# Altium schematic sheet Sheet1.SchDoc
size A; SheetNumber: 1; SheetTotal: 1
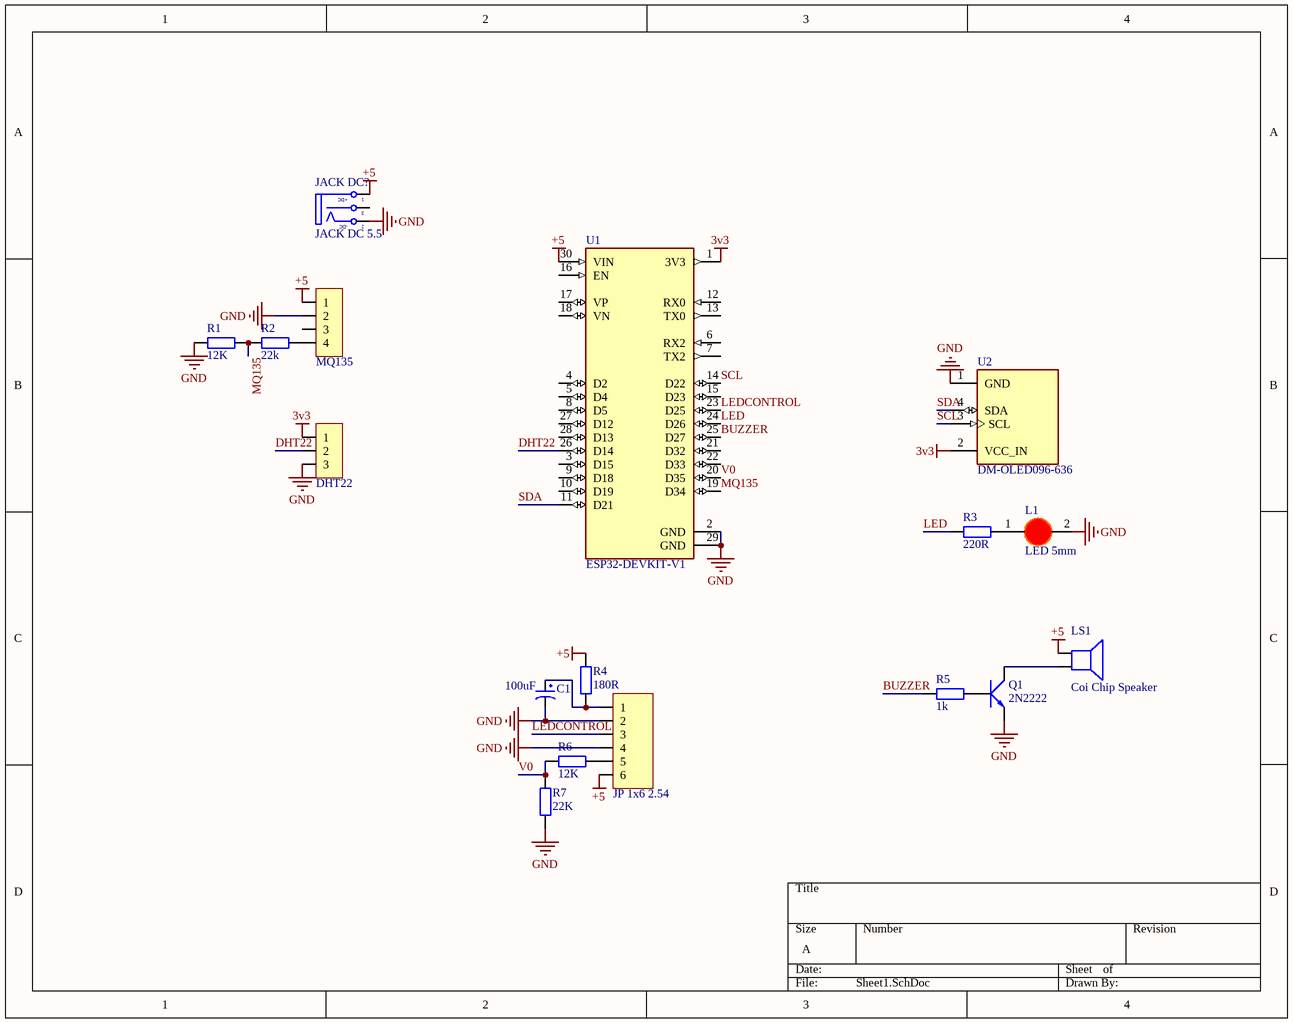
[diagram p0: Sheet1.SchDoc]

## Parts
C1  100uF  [tu hoa 5mm]
DHT1  DHT22  [JP 1x3 CT]
JACK_DC?  JACK DC 5.5  [JACK DC 5.5]
JP1  JP 1x6 2.54  [JP 1x6 DT]
L1  LED 5mm  [LED-5MM-RED]
LS1  Coi Chip Speaker  [Coi Chip Speacker]
MQ1  MQ135  [JP 1x4 CT]
Q1  2N2222  [TO92]
R1  12K  [tro vach 1/4w]
R2  22k  [tro vach 1/4w]
R3  220R  [tro vach 1/4w]
R4  180R  [tro vach 1/4w]
R5  1k  [tro vach 1/4w]
R6  12K  [tro vach 1/4w]
R7  22K  [tro vach 1/4w]
U1  ESP32-DEVKIT-V1  [MODULE_ESP32_DEVKIT_V1]
U2  DM-OLED096-636  [MODULE_DM-OLED096-636]

## Nets
3v3: DHT1.1 U1.1(3V3) U2.2(VCC_IN)
+5: JACK_DC?.1(T) JP1.6 LS1.1 MQ1.1 R4.1 U1.30(VIN)
GND: C1.2 DHT1.3 JACK_DC?.2(TN) JP1.2 JP1.4 L1.2(K) MQ1.2 Q1.1(E) R1.1 R7.1 U1.2(GND) U1.29(GND) U2.1(GND)
BUZZER: R5.1 U1.25(D27)
DHT22: DHT1.2 U1.26(D14)
LED: R3.1 U1.24(D26)
LEDCONTROL: JP1.3 U1.23(D25)
MQ135: R1.2 R2.1 U1.19(D34)
SCL: U1.14(D22) U2.3(SCL)
SDA: U1.11(D21) U2.4(SDA)
V0: R6.1 R7.2 U1.20(D35)
NetC1_1: C1.1 JP1.1 R4.2
NetJP1_5: JP1.5 R6.2
NetL1_1: L1.1(A) R3.2
NetLS1_2: LS1.2 Q1.3(C)
NetMQ1_4: MQ1.4 R2.2
NetQ1_2: Q1.2(B) R5.2

Not connected (* = marked no-connect by the designer): JACK_DC? 3(S); MQ1 3; U1 3(D15) 4(D2) 5(D4) 6(RX2) 7(TX2) 8(D5) 9(D18) 10(D19) 12(RX0) 13(TX0) 15(D23) 16(EN) 17(VP) 18(VN) 21(D32) 22(D33) 27(D12) 28(D13)

## Notes on the sheet
- (in symbol JACK DC 5.5) +DC; -DC

## Library data of the parts
C1 = Tu Hoa 100uF 25V 6x11: Cắm; Don_Vi: Con; So_Chan: 2; Ten_Linh_Kien: Tụ Hóa 100uF 25V 6x11MM; Ma_Hang: MH001351; Chung_Loai: Cắm; Kieu_Chan: *
DHT1 = JP 1x3 2.54 Cai Thang: Cắm; Ten_Linh_Kien: Jump Đơn Cái 2.54MM 1x20P Thẳng; Don_Vi: Con; Ma_Hang: MH004006; Ghi_Chu: *; Kieu_Chan: *; Chung_Loai: Cắm
JACK_DC? = JACK DC 5.5: Value: Jac DC
JP1 = JP 1x6 2.54 Duc Thang: Cắm; Ten_Linh_Kien: Jump Đơn Đực 2.54MM 1x40P Thẳng 11MM; Don_Vi: Con; Ma_Hang: MH000903; Ghi_Chu: *; Kieu_Chan: *; Chung_Loai: Cắm
L1 = LED 5mm Do: Cắm; Don_Vi: Con; Ma_Hang: MH008967; Ten_Linh_Kien: Led 5MM Phủ Đỏ (1000c); Ghi_Chu: *; Kieu_Chan: *; Chung_Loai: Cắm
LS1 = Coi Chip Speaker: Còi chip
MQ1 = JP 1x4 2.54 Cai Thang: Cắm; Ten_Linh_Kien: Jump Đơn Cái 2.54MM 1x20P Thẳng; Don_Vi: Con; Ma_Hang: MH004006; Ghi_Chu: *; Kieu_Chan: *; Chung_Loai: Cắm
Q1 = Trans 2N3904: NPN transistor EBC; Value: C9014
R1 R7 = Tro Vach 1/4W 5% 39k: Cắm; Don_Vi: Con; So_Chan: 2; Ten_Linh_Kien: Trở Vạch 1/4w 5% 39k; Ma_Hang: MH007314; Chung_Loai: Cắm; Kieu_Chan: *
R2 R6 = Tro Vach 1/4W 5% 22k: Cắm; Don_Vi: Con; So_Chan: 2; Ten_Linh_Kien: Trở Vạch 1/4w 5% 22k; Ma_Hang: MH007301; Chung_Loai: Cắm; Kieu_Chan: *
R3 = Tro Vach 1/4W 5% 220R: Cắm; Don_Vi: Con; So_Chan: 2; Ten_Linh_Kien: Trở Vạch 1/4w 5% 220R; Ma_Hang: MH007300; Chung_Loai: Cắm; Kieu_Chan: *
R4 = Tro Vach 1/4W 5% 180R: Cắm; Don_Vi: Con; Ten_Linh_Kien: Trở Vạch 1/4w 5% 180R; Ma_Hang: MH007290; So_Chan: 2; Chung_Loai: Cắm; Kieu_Chan: *
R5 = Tro Vach 1/4W 5% 1k: Cắm; Don_Vi: Con; So_Chan: 2; Ten_Linh_Kien: Trở Vạch 1/4w 5% 1k; Ma_Hang: MH007390; Chung_Loai: Cắm; Kieu_Chan: *
U1 = ESP32-DEVKIT-V1: Dual core, Wi-Fi: 2.4 GHz up to 150 Mbits/s,BLE (Bluetooth Low Energy) and legacy Bluetooth, 32 bits, Up to 240 MHz; MF: Do it; SnapEDA_Link: https://www.snapeda.com/parts/ESP32-DEVKIT-V1/Do+it/view-part/?ref=snap; Package: None; Value: *; MP: ESP32-DEVKIT-V1; Check_prices: https://www.snapeda.com/parts/ESP32-DEVKIT-V1/Do+it/view-part/?ref=eda
U2 = DM-OLED096-636: 0.96â€ 128 X 64 MONOCHROME GRAPHIC OLED DISPLAY MODULE - I2C; SnapEDA_Link: https://www.snapeda.com/parts/DM-OLED096-636/Display+Module/view-part/?ref=snap; Package: Package; Value: *; MF: Display Module; MP: DM-OLED096-636; Check_prices: https://www.snapeda.com/parts/DM-OLED096-636/Display+Module/view-part/?ref=eda